# Altium schematic sheet OSPLC2_2_CPU1.SchDoc
size 294 x 198 mm
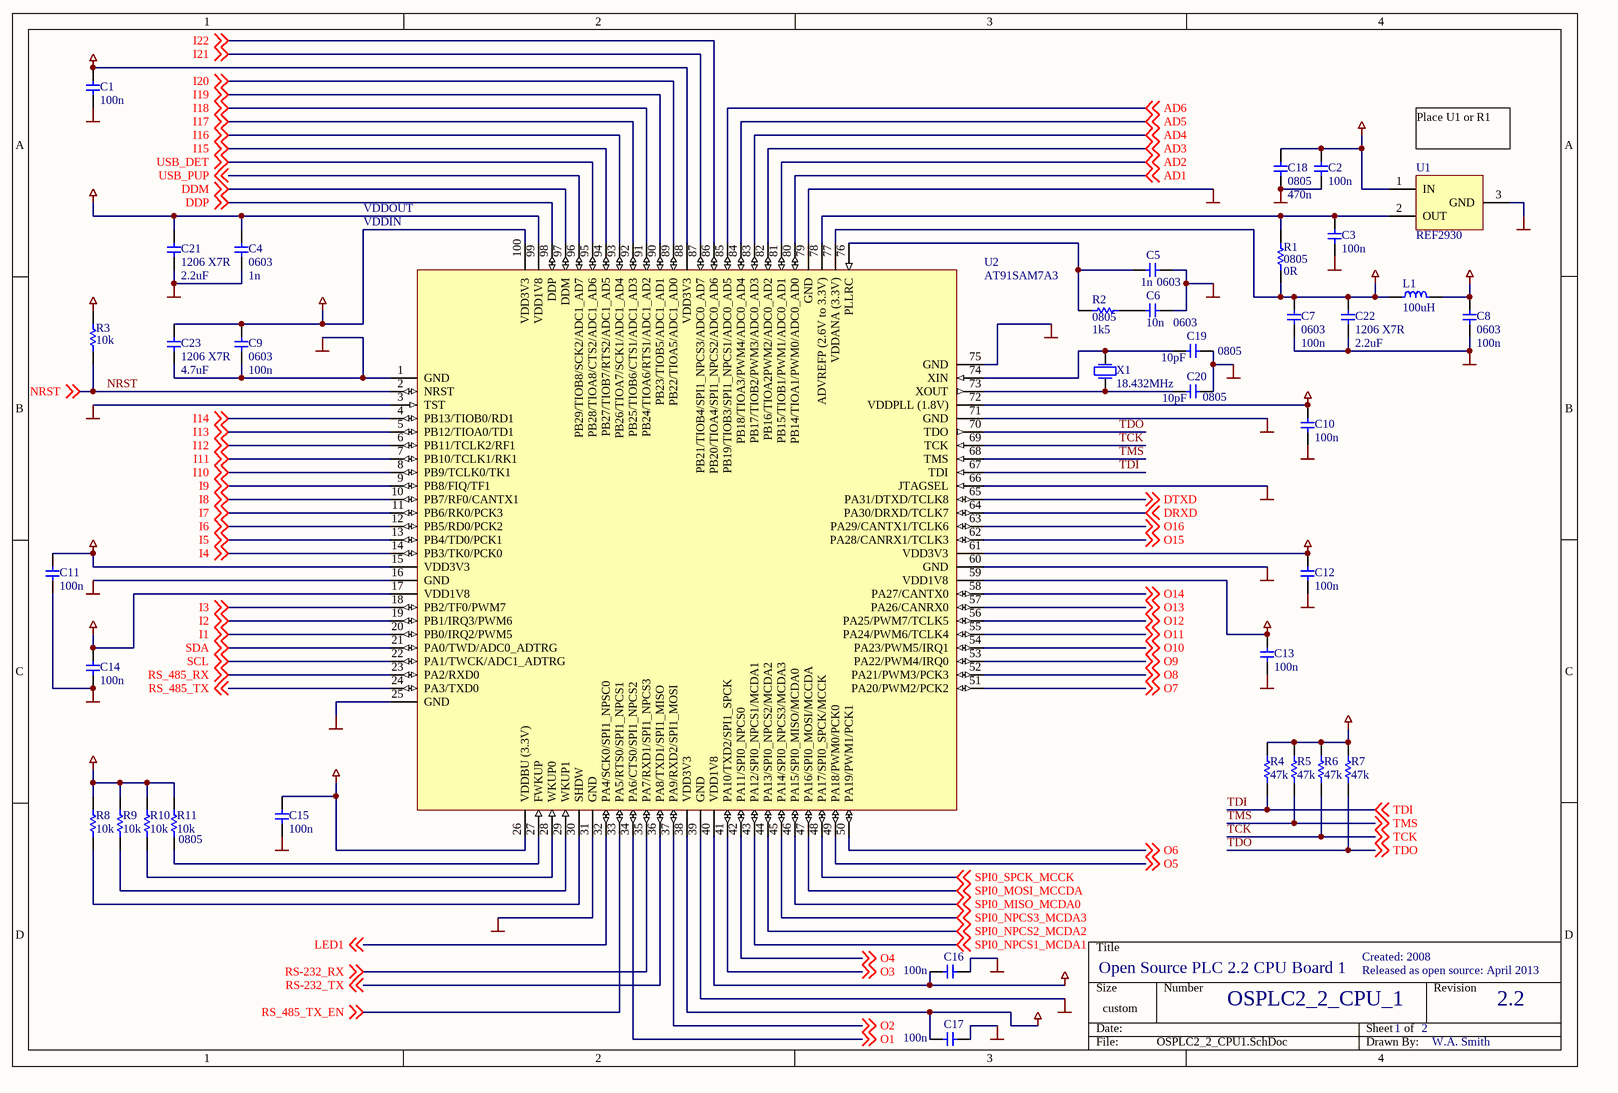
[diagram p0: OSPLC2_2_CPU1.SchDoc]

## Parts
C1  value 100n  [0603]  (hidden comment: 0603)
C2  value 100n  [0603]  (hidden comment: 0603)
C3  value 100n  [0603]  (hidden comment: 0603)
C4  0603  value 1n  [0603]
C5  0603  value 1n  [0603]
C6  0603  value 10n  [0603]
C7  0603  value 100n  [0603]
C8  0603  value 100n  [0603]
C9  0603  value 100n  [0603]
C10  value 100n  [0603]  (hidden comment: 0603)
C11  value 100n  [0603]  (hidden comment: 0603)
C12  value 100n  [0603]  (hidden comment: 0603)
C13  value 100n  [0603]  (hidden comment: 0603)
C14  value 100n  [0603]  (hidden comment: 0603)
C15  value 100n  [0603]  (hidden comment: 0603)
C16  value 100n  [0603]  (hidden comment: 0603)
C17  value 100n  [0603]  (hidden comment: 0603)
C18  0805  value 470n  [0805]
C19  0805  value 10pF  [0805]
C20  0805  value 10pF  [0805]
C21  1206 X7R  value 2.2uF  [1206]
C22  1206 X7R  value 2.2uF  [1206]
C23  1206 X7R  value 4.7uF  [1206]
L1  100uH  [1206]
R1  0805  value 0R  [0805]
R2  0805  value 1k5  [0805]
R3  value 10k  [0805]  (hidden comment: 0805)
R4  value 47k  [0805]  (hidden comment: 0805)
R5  value 47k  [0805]  (hidden comment: 0805)
R6  value 47k  [0805]  (hidden comment: 0805)
R7  value 47k  [0805]  (hidden comment: 0805)
R8  value 10k  [0805]  (hidden comment: 0805)
R9  value 10k  [0805]  (hidden comment: 0805)
R10  value 10k  [0805]  (hidden comment: 0805)
R11  0805  value 10k  [0805]
U1  REF2930  [SOT23-3]
U2  AT91SAM7A3  [F-QFP14x14-G100/X.3N]
X1  18.432MHz  [CRYSTAL_SMT]

## Nets
ADC3v3: C2.2 C7.2 C18.2 C22.2 L1.1 R1.1 U1.1(IN) U2.77(VDDANA_(3.3V))
GND: C1.1 C2.1 C3.1 C4.1 C5.2 C6.2 C7.1 C8.1 C9.1 C10.1 C11.1 C12.1 C13.1 C14.1 C15.1 C16.1 C17.1 C18.1 C19.2 C20.2 C21.1 C22.1 C23.1 U1.3(GND) U2.1(GND) U2.3(TST) U2.16(GND) U2.25(GND) U2.31(GND) U2.39(GND) U2.60(GND) U2.66(JTAGSEL) U2.71(GND) U2.75(GND) U2.79(GND)
VCC1v8: C4.2 C10.2 C13.2 C14.2 C16.2 C21.2 U2.17(VDD1V8) U2.40(VDD1V8) U2.59(VDD1V8) U2.72(VDDPLL_(1.8V)) U2.99(VDD1V8)
VCC3v3: C1.2 C8.2 C9.2 C11.2 C12.2 C15.2 C17.2 C23.2 L1.2 R3.2 R4.2 R5.2 R6.2 R7.2 R8.2 R9.2 R10.2 R11.2 U2.15(VDD3V3) U2.26(VDDBU_(3.3V)) U2.38(VDD3V3) U2.61(VDD3V3) U2.88(VDD3V3) U2.100(VDD3V3)
AD1: U2.80(PB14/TIOA1/PWM0/ADC0_AD0) ; off-sheet AD1
AD2: U2.81(PB15/TIOB1/PWM1/ADC0_AD1) ; off-sheet AD2
AD3: U2.82(PB16/TIOA2PWM2/ADC0_AD2) ; off-sheet AD3
AD4: U2.83(PB17/TIOB2/PWM3/ADC0_AD3) ; off-sheet AD4
AD5: U2.84(PB18/TIOA3/PWM4/ADC0_AD4) ; off-sheet AD5
AD6: U2.85(PB19/TIOB3/SPI1_NPCS1/ADC0_AD5) ; off-sheet AD6
DDM: U2.97(DDM) ; off-sheet DDM
DDP: U2.98(DDP) ; off-sheet DDP
DRXD: U2.64(PA30/DRXD/TCLK7) ; off-sheet DRXD
DTXD: U2.65(PA31/DTXD/TCLK8) ; off-sheet DTXD
I1: U2.20(PB0/IRQ2/PWM5) ; off-sheet I1
I2: U2.19(PB1/IRQ3/PWM6) ; off-sheet I2
I3: U2.18(PB2/TF0/PWM7) ; off-sheet I3
I4: U2.14(PB3/TK0/PCK0) ; off-sheet I4
I5: U2.13(PB4/TD0/PCK1) ; off-sheet I5
I6: U2.12(PB5/RD0/PCK2) ; off-sheet I6
I7: U2.11(PB6/RK0/PCK3) ; off-sheet I7
I8: U2.10(PB7/RF0/CANTX1) ; off-sheet I8
I9: U2.9(PB8/FIQ/TF1) ; off-sheet I9
I10: U2.8(PB9/TCLK0/TK1) ; off-sheet I10
I11: U2.7(PB10/TCLK1/RK1) ; off-sheet I11
I12: U2.6(PB11/TCLK2/RF1) ; off-sheet I12
I13: U2.5(PB12/TIOA0/TD1) ; off-sheet I13
I14: U2.4(PB13/TIOB0/RD1) ; off-sheet I14
I15: U2.94(PB27/TIOB7/RTS2/ADC1_AD5) ; off-sheet I15
I16: U2.93(PB26/TIOA7/SCK1/ADC1_AD4) ; off-sheet I16
I17: U2.92(PB25/TIOB6/CTS1/ADC1_AD3) ; off-sheet I17
I18: U2.91(PB24/TIOA6/RTS1/ADC1_AD2) ; off-sheet I18
I19: U2.90(PB23/TIOB5/ADC1_AD1) ; off-sheet I19
I20: U2.89(PB22/TIOA5/ADC1_AD0) ; off-sheet I20
I21: U2.87(PB21/TIOB4/SPI1_NPCS3/ADC0_AD7) ; off-sheet I21
I22: U2.86(PB20/TIOA4/SPI1_NPCS2/ADC0_AD6) ; off-sheet I22
LED1: U2.32(PA4/SCK0/SPI1_NPSC0) ; off-sheet LED1
NRST: R3.1 U2.2(NRST) ; off-sheet NRST
O1: U2.34(PA6/CTS0/SPI1_NPCS2) ; off-sheet O1
O2: U2.37(PA9/RXD2/SPI1_MOSI) ; off-sheet O2
O3: U2.41(PA10/TXD2/SPI1_SPCK) ; off-sheet O3
O4: U2.42(PA11/SPI0_NPCS0) ; off-sheet O4
O5: U2.49(PA18/PWM0/PCK0) ; off-sheet O5
O6: U2.50(PA19/PWM1/PCK1) ; off-sheet O6
O7: U2.51(PA20/PWM2/PCK2) ; off-sheet O7
O8: U2.52(PA21/PWM3/PCK3) ; off-sheet O8
O9: U2.53(PA22/PWM4/IRQ0) ; off-sheet O9
O10: U2.54(PA23/PWM5/IRQ1) ; off-sheet O10
O11: U2.55(PA24/PWM6/TCLK4) ; off-sheet O11
O12: U2.56(PA25/PWM7/TCLK5) ; off-sheet O12
O13: U2.57(PA26/CANRX0) ; off-sheet O13
O14: U2.58(PA27/CANTX0) ; off-sheet O14
O15: U2.62(PA28/CANRX1/TCLK3) ; off-sheet O15
O16: U2.63(PA29/CANTX1/TCLK6) ; off-sheet O16
RS-232_RX: U2.35(PA7/RXD1/SPI1_NPCS3) ; off-sheet RS-232_RX
RS-232_TX: U2.36(PA8/TXD1/SPI1_MISO) ; off-sheet RS-232_TX
RS_485_RX: U2.23(PA2/RXD0) ; off-sheet RS_485_RX
RS_485_TX: U2.24(PA3/TXD0) ; off-sheet RS_485_TX
RS_485_TX_EN: U2.33(PA5/RTS0/SPI1_NPCS1) ; off-sheet RS_485_TX_EN
SCL: U2.22(PA1/TWCK/ADC1_ADTRG) ; off-sheet SCL
SDA: U2.21(PA0/TWD/ADC0_ADTRG) ; off-sheet SDA
SPI0_MISO_MCDA0: U2.46(PA15/SPI0_MISO/MCDA0) ; off-sheet SPI0_MISO_MCDA0
SPI0_MOSI_MCCDA: U2.47(PA16/SPI0_MOSI/MCCDA) ; off-sheet SPI0_MOSI_MCCDA
SPI0_NPCS1_MCDA1: U2.43(PA12/SPI0_NPCS1/MCDA1) ; off-sheet SPI0_NPCS1_MCDA1
SPI0_NPCS2_MCDA2: U2.44(PA13/SPI0_NPCS2/MCDA2) ; off-sheet SPI0_NPCS2_MCDA2
SPI0_NPCS3_MCDA3: U2.45(PA14/SPI0_NPCS3/MCDA3) ; off-sheet SPI0_NPCS3_MCDA3
SPI0_SPCK_MCCK: U2.48(PA17/SPI0_SPCK/MCCK) ; off-sheet SPI0_SPCK_MCCK
TCK: R6.1 U2.69(TCK) ; off-sheet TCK
TDI: R4.1 U2.67(TDI) ; off-sheet TDI
TDO: R7.1 U2.70(TDO) ; off-sheet TDO
TMS: R5.1 U2.68(TMS) ; off-sheet TMS
USB_DET: U2.95(PB28/TIOA8/CTS2/ADC1_AD6) ; off-sheet USB_DET
USB_PUP: U2.96(PB29/TIOB8/SCK2/ADC1_AD7) ; off-sheet USB_PUP
NetC3_2: C3.2 R1.2 U1.2(OUT) U2.78(ADVREFP_(2.6V_to_3.3V))
NetC5_1: C5.1 R2.1 U2.76(PLLRC)
NetC6_1: C6.1 R2.2
NetC19_1: C19.1 U2.74(XIN) X1.1(X)
NetC20_1: C20.1 U2.73(XOUT) X1.2(X)
NetR8_1: R8.1 U2.30(SHDW)
NetR9_1: R9.1 U2.29(WKUP1)
NetR10_1: R10.1 U2.28(WKUP0)
NetR11_1: R11.1 U2.27(FWKUP)

## Notes on the sheet
- (near U1) Place U1 or R1
- VDDOUT
- (near U2) VDDIN
- Created: 2008
- Open Source PLC 2.2 CPU Board 1
- OSPLC2_2_CPU_1
- Released as open source: April 2013
- 2.2
- 1
- 2
- W.A. Smith

## Library data of the parts
C1-C17 = CAP_0603: 0603 footprint non-polorised capacitor
C18-C20 = CAP_0805: 0805 footprint non-polarised capacitor
C21-C23 = CAP_1206: 1206 footprint non-polorised capacitor
L1 = INDUCTOR_1206: muRata Chip Coil; Part No.: LQH31MN101J03; Value: 100uH
R1-R11 = RES_0805: 0805 footprint resistor
U1 = REF2930: 3V LDO Voltage Reference; Value: REF2930
U2 = AT91SAM7A3: Atmel AT91 ARM Microcontroller with CAN ports; Value: AT91SAM7A3
X1 = CRYSTAL_SMT: SMT crystal